# Altium schematic sheet switch 2.SchDoc
size A4; SheetNumber: 2; SheetTotal: 5
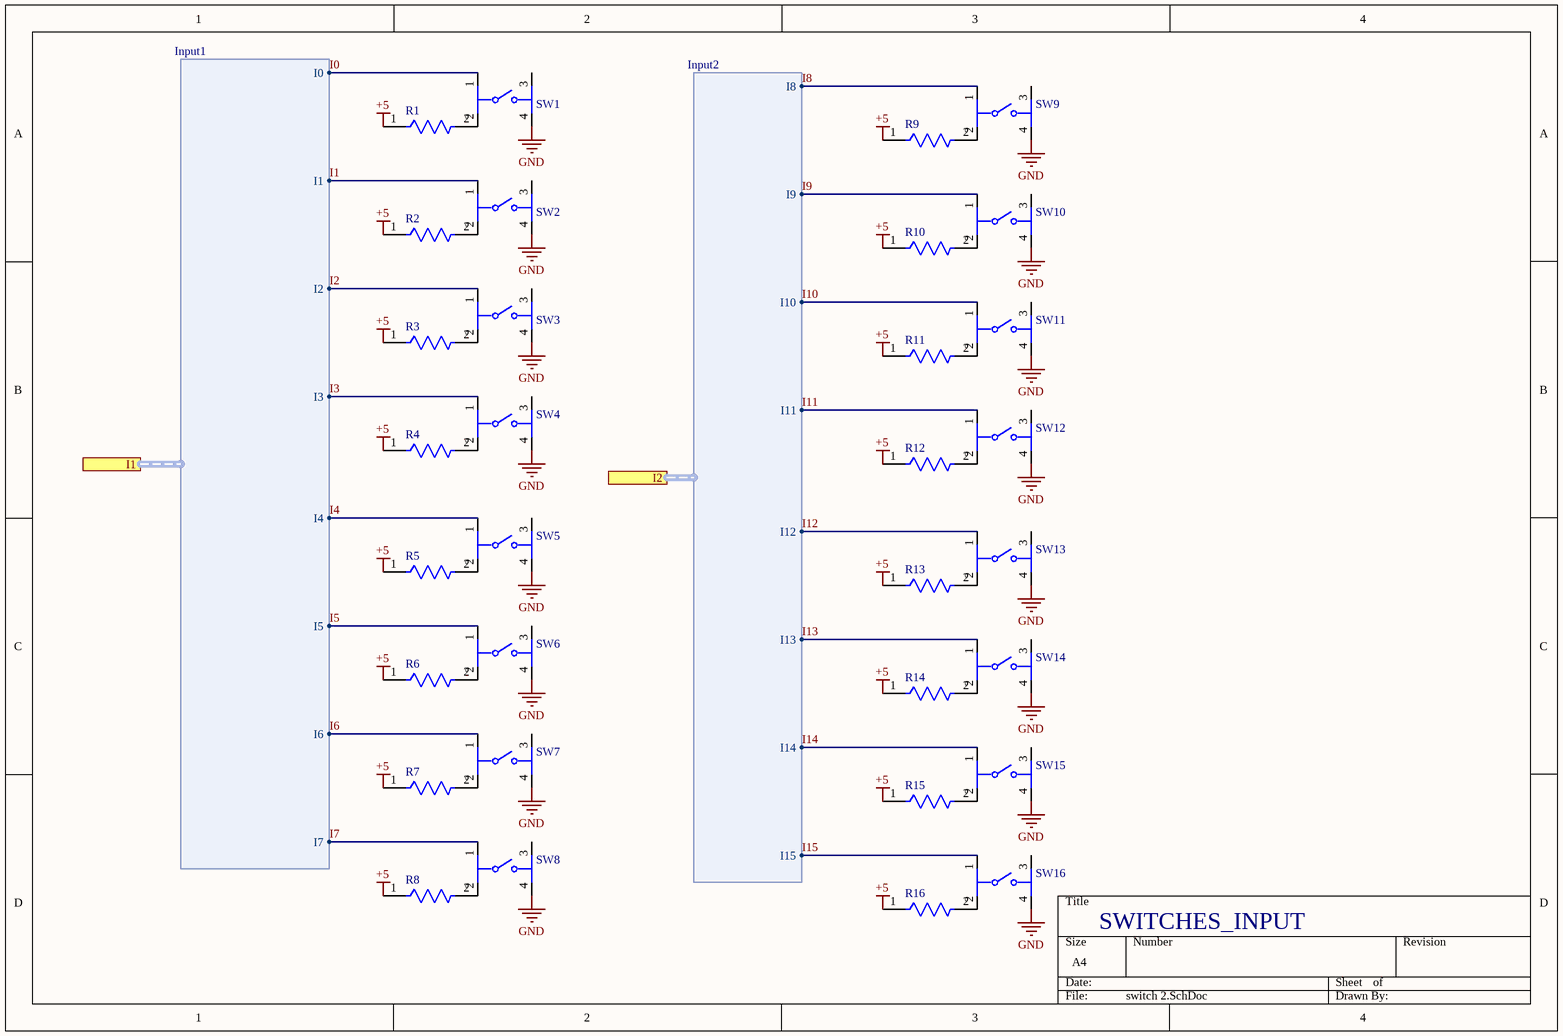
[diagram p0: switch 2.SchDoc]

## Parts
R1  MRS25000C1001FCT00  [FP-MRS25-MFG]  (value not drawn)
R2  MRS25000C1001FCT00  [FP-MRS25-MFG]  (value not drawn)
R3  MRS25000C1001FCT00  [FP-MRS25-MFG]  (value not drawn)
R4  MRS25000C1001FCT00  [FP-MRS25-MFG]  (value not drawn)
R5  MRS25000C1001FCT00  [FP-MRS25-MFG]  (value not drawn)
R6  MRS25000C1001FCT00  [FP-MRS25-MFG]  (value not drawn)
R7  MRS25000C1001FCT00  [FP-MRS25-MFG]  (value not drawn)
R8  MRS25000C1001FCT00  [FP-MRS25-MFG]  (value not drawn)
R9  MRS25000C1001FCT00  [FP-MRS25-MFG]  (value not drawn)
R10  MRS25000C1001FCT00  [FP-MRS25-MFG]  (value not drawn)
R11  MRS25000C1001FCT00  [FP-MRS25-MFG]  (value not drawn)
R12  MRS25000C1001FCT00  [FP-MRS25-MFG]  (value not drawn)
R13  MRS25000C1001FCT00  [FP-MRS25-MFG]  (value not drawn)
R14  MRS25000C1001FCT00  [FP-MRS25-MFG]  (value not drawn)
R15  MRS25000C1001FCT00  [FP-MRS25-MFG]  (value not drawn)
R16  MRS25000C1001FCT00  [FP-MRS25-MFG]  (value not drawn)
SW1  1-1825910-5  [FP-1-1825910-5-MFG]  (value not drawn)
SW2  1-1825910-5  [FP-1-1825910-5-MFG]  (value not drawn)
SW3  1-1825910-5  [FP-1-1825910-5-MFG]  (value not drawn)
SW4  1-1825910-5  [FP-1-1825910-5-MFG]  (value not drawn)
SW5  1-1825910-5  [FP-1-1825910-5-MFG]  (value not drawn)
SW6  1-1825910-5  [FP-1-1825910-5-MFG]  (value not drawn)
SW7  1-1825910-5  [FP-1-1825910-5-MFG]  (value not drawn)
SW8  1-1825910-5  [FP-1-1825910-5-MFG]  (value not drawn)
SW9  1-1825910-5  [FP-1-1825910-5-MFG]  (value not drawn)
SW10  1-1825910-5  [FP-1-1825910-5-MFG]  (value not drawn)
SW11  1-1825910-5  [FP-1-1825910-5-MFG]  (value not drawn)
SW12  1-1825910-5  [FP-1-1825910-5-MFG]  (value not drawn)
SW13  1-1825910-5  [FP-1-1825910-5-MFG]  (value not drawn)
SW14  1-1825910-5  [FP-1-1825910-5-MFG]  (value not drawn)
SW15  1-1825910-5  [FP-1-1825910-5-MFG]  (value not drawn)
SW16  1-1825910-5  [FP-1-1825910-5-MFG]  (value not drawn)

## Ports
I1 (harness Input1, see encode and decode 2[1B]), I2 (harness Input2, see encode and decode 2[1C])

## Harnesses
Input1: I0, I1, I2, I3, I4, I5, I6, I7
Input2: I15, I14, I13, I12, I11, I10, I9, I8

## Nets
+5: R1.1 R2.1 R3.1 R4.1 R5.1 R6.1 R7.1 R8.1 R9.1 R10.1 R11.1 R12.1 R13.1 R14.1 R15.1 R16.1
GND: SW1.4 SW2.4 SW3.4 SW4.4 SW5.4 SW6.4 SW7.4 SW8.4 SW9.4 SW10.4 SW11.4 SW12.4 SW13.4 SW14.4 SW15.4 SW16.4
I0: SW1.1 ; port I1.I0
I1: SW2.1 ; port I1.I1
I2: SW3.1 ; port I1.I2
I3: SW4.1 ; port I1.I3
I4: SW5.1 ; port I1.I4
I5: SW6.1 ; port I1.I5
I6: SW7.1 ; port I1.I6
I7: SW8.1 ; port I1.I7
I8: SW9.1 ; port I2.I8
I9: SW10.1 ; port I2.I9
I10: SW11.1 ; port I2.I10
I11: SW12.1 ; port I2.I11
I12: SW13.1 ; port I2.I12
I13: SW14.1 ; port I2.I13
I14: SW15.1 ; port I2.I14
I15: SW16.1 ; port I2.I15
NetR1_2: R1.2 SW1.2
NetR2_2: R2.2 SW2.2
NetR3_2: R3.2 SW3.2
NetR4_2: R4.2 SW4.2
NetR5_2: R5.2 SW5.2
NetR6_2: R6.2 SW6.2
NetR7_2: R7.2 SW7.2
NetR8_2: R8.2 SW8.2
NetR9_2: R9.2 SW9.2
NetR10_2: R10.2 SW10.2
NetR11_2: R11.2 SW11.2
NetR12_2: R12.2 SW12.2
NetR13_2: R13.2 SW13.2
NetR14_2: R14.2 SW14.2
NetR15_2: R15.2 SW15.2
NetR16_2: R16.2 SW16.2

Not connected (* = marked no-connect by the designer): SW1 3; SW2 3; SW3 3; SW4 3; SW5 3; SW6 3; SW7 3; SW8 3; SW9 3; SW10 3; SW11 3; SW12 3; SW13 3; SW14 3; SW15 3; SW16 3

## Notes on the sheet
- SWITCHES_INPUT

## Library data of the parts
R1-R16 = CMP-02408-000051-1: RES 1K OHM 0.6W 1% AXIAL; Power Rating: 600mW; Lead Diameter: 0.6mm; Voltage Rating (DC): 350V; Resistance: 1kR; Temperature Coefficient: 50ppm/°C; Width: 2.5mm; Military Standard: Not; Package Quantity: 5000; Radiation Hardening: No; Case/Package: Axial; Resistance Tolerance: 1%; Resistor Type: Metal Film; Contact Plating: Tin; Length: 6.5mm; Lead Free: Lead Free; RoHS Compliant: Yes; Mount: Through Hole; Number of Pins: 2; Technology: THIN FILM; Voltage Rating: 350V; Min Operating Temperature: -55°C; Weight: 0.00776oz; Diameter: 2.5mm; Construction: Cylindrical; Series: MRS25; Tolerance: 1%; Packaging: Tape and Reel; Max Operating Temperature: 155°C; Max Power Dissipation: 600mW; Number of Terminations: 2; Termination: Axial
SW1-SW16 = CMP-03407-000006-1: SWITCH TACTILE SPST-NO 0.05A 24V; Contact Current Rating: 50mA; Actuator Length: 5.9mm; Switch Travel: 0.25mm; Electrical Life: 100000Cycles; Operating Force: 2.55N; Actuator Color: Red; Switch Function: Off-Mom; Throw Configuration: SPST; Contact Resistance: 100mR; Actuator Material: PBT; Actuator Type: Standard; Illumination Type: Non-Illuminated; Package Quantity: 750; Contact Plating: Silver; Length: 5.99mm; Contact Material: Brass; Type: Switch; Max Operating Temperature: 85°C; Orientation: Straight; Mechanical Life: 100000Cycles; Max Voltage Rating (DC): 24V; Series: FSMJ, Alcoswitch; Max Current Rating: 50mA; Radiation Hardening: No; Min Operating Temperature: -35°C; RoHS Compliant: Yes; Mount: Through Hole; Voltage Rating (DC): 24V; Termination: PC Pins; Packaging: Loose Piece